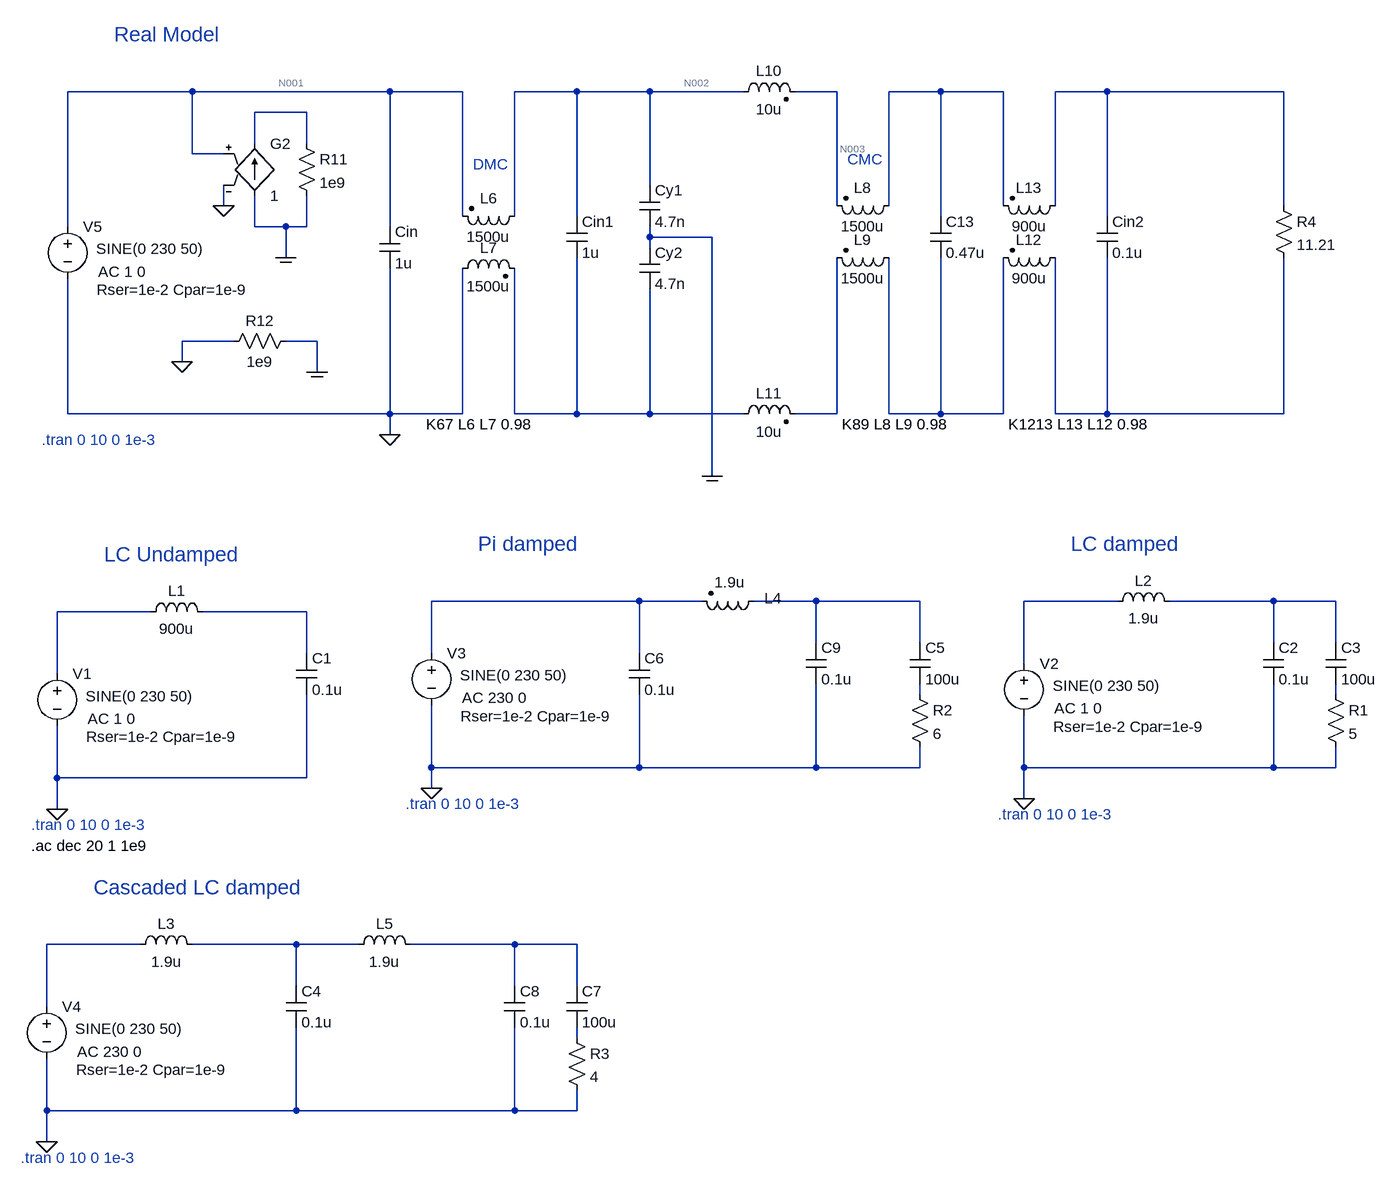
[diagram p0: schematic Input_Filter.asc]
Input_Filter.asc, the LTspice schematic file:
Version 4
SHEET 1 2692 3464
WIRE -2384 1808 -2576 1808
WIRE -2080 1808 -2384 1808
WIRE -1968 1808 -2080 1808
WIRE -1792 1808 -1888 1808
WIRE -1680 1808 -1792 1808
WIRE -1536 1808 -1680 1808
WIRE -1392 1808 -1456 1808
WIRE -1232 1808 -1312 1808
WIRE -1136 1808 -1232 1808
WIRE -976 1808 -1056 1808
WIRE -704 1808 -976 1808
WIRE -2208 1840 -2288 1840
WIRE -2288 1888 -2288 1840
WIRE -2208 1888 -2208 1840
WIRE -2384 1904 -2384 1808
WIRE -2336 1904 -2384 1904
WIRE -1680 1952 -1680 1808
WIRE -2336 1984 -2336 1952
WIRE -1392 1984 -1392 1808
WIRE -1312 1984 -1312 1808
WIRE -1136 1984 -1136 1808
WIRE -1056 1984 -1056 1808
WIRE -704 1984 -704 1808
WIRE -1968 2000 -1968 1808
WIRE -1888 2000 -1888 1808
WIRE -1792 2000 -1792 1808
WIRE -1232 2000 -1232 1808
WIRE -976 2000 -976 1808
WIRE -2576 2016 -2576 1808
WIRE -2288 2016 -2288 1968
WIRE -2240 2016 -2288 2016
WIRE -2208 2016 -2208 1968
WIRE -2208 2016 -2240 2016
WIRE -2080 2016 -2080 1808
WIRE -1680 2032 -1680 2016
WIRE -1584 2032 -1680 2032
WIRE -1680 2048 -1680 2032
WIRE -2240 2064 -2240 2016
WIRE -2320 2192 -2400 2192
WIRE -2192 2192 -2240 2192
WIRE -2400 2224 -2400 2192
WIRE -2192 2240 -2192 2192
WIRE -2576 2304 -2576 2096
WIRE -2080 2304 -2080 2080
WIRE -2080 2304 -2576 2304
WIRE -1968 2304 -1968 2080
WIRE -1968 2304 -2080 2304
WIRE -1888 2304 -1888 2080
WIRE -1792 2304 -1792 2064
WIRE -1792 2304 -1888 2304
WIRE -1680 2304 -1680 2112
WIRE -1680 2304 -1792 2304
WIRE -1536 2304 -1680 2304
WIRE -1392 2304 -1392 2064
WIRE -1392 2304 -1456 2304
WIRE -1312 2304 -1312 2064
WIRE -1232 2304 -1232 2064
WIRE -1232 2304 -1312 2304
WIRE -1136 2304 -1136 2064
WIRE -1136 2304 -1232 2304
WIRE -1056 2304 -1056 2064
WIRE -976 2304 -976 2064
WIRE -976 2304 -1056 2304
WIRE -704 2304 -704 2064
WIRE -704 2304 -976 2304
WIRE -2080 2336 -2080 2304
WIRE -1584 2400 -1584 2032
WIRE -1696 2592 -2016 2592
WIRE -1600 2592 -1696 2592
WIRE -1424 2592 -1520 2592
WIRE -1264 2592 -1424 2592
WIRE -960 2592 -1104 2592
WIRE -720 2592 -880 2592
WIRE -624 2592 -720 2592
WIRE -2448 2608 -2592 2608
WIRE -2208 2608 -2368 2608
WIRE -1424 2656 -1424 2592
WIRE -1264 2656 -1264 2592
WIRE -720 2656 -720 2592
WIRE -624 2656 -624 2592
WIRE -2208 2672 -2208 2608
WIRE -2016 2672 -2016 2592
WIRE -1696 2672 -1696 2592
WIRE -1104 2688 -1104 2592
WIRE -2592 2704 -2592 2608
WIRE -1264 2736 -1264 2720
WIRE -624 2736 -624 2720
WIRE -2016 2848 -2016 2752
WIRE -1696 2848 -1696 2736
WIRE -1696 2848 -2016 2848
WIRE -1424 2848 -1424 2720
WIRE -1424 2848 -1696 2848
WIRE -1264 2848 -1264 2816
WIRE -1264 2848 -1424 2848
WIRE -1104 2848 -1104 2768
WIRE -720 2848 -720 2720
WIRE -720 2848 -1104 2848
WIRE -624 2848 -624 2816
WIRE -624 2848 -720 2848
WIRE -2592 2864 -2592 2784
WIRE -2208 2864 -2208 2736
WIRE -2208 2864 -2592 2864
WIRE -2016 2880 -2016 2848
WIRE -1104 2896 -1104 2848
WIRE -2592 2912 -2592 2864
WIRE -2464 3120 -2608 3120
WIRE -2224 3120 -2384 3120
WIRE -2128 3120 -2224 3120
WIRE -1888 3120 -2048 3120
WIRE -1792 3120 -1888 3120
WIRE -2224 3184 -2224 3120
WIRE -1888 3184 -1888 3120
WIRE -1792 3184 -1792 3120
WIRE -2608 3216 -2608 3120
WIRE -1792 3264 -1792 3248
WIRE -2608 3376 -2608 3296
WIRE -2224 3376 -2224 3248
WIRE -2224 3376 -2608 3376
WIRE -1888 3376 -1888 3248
WIRE -1888 3376 -2224 3376
WIRE -1792 3376 -1792 3344
WIRE -1792 3376 -1888 3376
WIRE -2608 3424 -2608 3376
FLAG -2592 2912 0
FLAG -1104 2896 0
FLAG -2016 2880 0
FLAG -2608 3424 0
FLAG -2080 2336 0
FLAG -1584 2400 COM
FLAG -2240 2064 COM
FLAG -2336 1984 0
FLAG -2400 2224 0
FLAG -2192 2240 COM
DATAFLAG -2592 2864 ""
DATAFLAG -2592 2864 ""
DATAFLAG -1104 2848 ""
DATAFLAG -1104 2848 ""
DATAFLAG -2016 2832 ""
DATAFLAG -2016 2832 ""
DATAFLAG -2608 3376 ""
DATAFLAG -2608 3376 ""
DATAFLAG -2256 2608 ""
SYMBOL voltage -2592 2688 R0
WINDOW 3 44 50 Left 2
WINDOW 123 47 85 Left 2
WINDOW 39 45 113 Left 2
SYMATTR Value SINE(0 230 50)
SYMATTR Value2 AC 1 0
SYMATTR SpiceLine Rser=1e-2 Cpar=1e-9
SYMATTR InstName V1
SYMBOL ind -2464 2624 R270
WINDOW 0 32 56 VTop 2
WINDOW 3 5 56 VBottom 2
SYMATTR InstName L1
SYMATTR Value 900u
SYMBOL cap -2224 2672 R0
SYMATTR InstName C1
SYMATTR Value 0.1u
SYMBOL voltage -1104 2672 R0
WINDOW 3 44 50 Left 2
WINDOW 123 47 85 Left 2
WINDOW 39 45 113 Left 2
SYMATTR Value SINE(0 230 50)
SYMATTR Value2 AC 1 0
SYMATTR SpiceLine Rser=1e-2 Cpar=1e-9
SYMATTR InstName V2
SYMBOL ind -976 2608 R270
WINDOW 0 32 56 VTop 2
WINDOW 3 5 56 VBottom 2
SYMATTR InstName L2
SYMATTR Value 1.9u
SYMATTR SpiceLine Ipk=30 Rser=1e-9
SYMBOL cap -736 2656 R0
SYMATTR InstName C2
SYMATTR Value 0.1u
SYMBOL res -640 2720 R0
SYMATTR InstName R1
SYMATTR Value 5
SYMBOL cap -640 2656 R0
SYMATTR InstName C3
SYMATTR Value 100u
SYMBOL voltage -2016 2656 R0
WINDOW 3 44 50 Left 2
WINDOW 123 47 85 Left 2
WINDOW 39 45 113 Left 2
SYMATTR Value SINE(0 230 50)
SYMATTR Value2 AC 230 0
SYMATTR SpiceLine Rser=1e-2 Cpar=1e-9
SYMATTR InstName V3
SYMBOL res -1280 2720 R0
SYMATTR InstName R2
SYMATTR Value 6
SYMBOL cap -1280 2656 R0
SYMATTR InstName C5
SYMATTR Value 100u
SYMBOL cap -1712 2672 R0
SYMATTR InstName C6
SYMATTR Value 0.1u
SYMBOL cap -1440 2656 R0
SYMATTR InstName C9
SYMATTR Value 0.1u
SYMBOL ind2 -1504 2576 R90
WINDOW 0 27 -14 VBottom 2
WINDOW 3 -29 53 VTop 2
SYMATTR InstName L4
SYMATTR Value 1.9u
SYMATTR Type ind
SYMBOL voltage -2608 3200 R0
WINDOW 3 44 50 Left 2
WINDOW 123 47 85 Left 2
WINDOW 39 45 113 Left 2
SYMATTR Value SINE(0 230 50)
SYMATTR Value2 AC 230 0
SYMATTR SpiceLine Rser=1e-2 Cpar=1e-9
SYMATTR InstName V4
SYMBOL ind -2480 3136 R270
WINDOW 0 32 56 VTop 2
WINDOW 3 5 56 VBottom 2
SYMATTR InstName L3
SYMATTR Value 1.9u
SYMATTR SpiceLine Ipk=30 Rser=1e-9
SYMBOL cap -2240 3184 R0
SYMATTR InstName C4
SYMATTR Value 0.1u
SYMBOL res -1808 3248 R0
SYMATTR InstName R3
SYMATTR Value 4
SYMBOL cap -1808 3184 R0
SYMATTR InstName C7
SYMATTR Value 100u
SYMBOL ind -2144 3136 R270
WINDOW 0 32 56 VTop 2
WINDOW 3 5 56 VBottom 2
SYMATTR InstName L5
SYMATTR Value 1.9u
SYMATTR SpiceLine Ipk=30 Rser=1e-9
SYMBOL cap -1904 3184 R0
SYMATTR InstName C8
SYMATTR Value 0.1u
SYMBOL voltage -2576 2000 R0
WINDOW 3 44 50 Left 2
WINDOW 123 47 85 Left 2
WINDOW 39 45 113 Left 2
SYMATTR Value SINE(0 230 50)
SYMATTR Value2 AC 1 0
SYMATTR SpiceLine Rser=1e-2 Cpar=1e-9
SYMATTR InstName V5
SYMBOL cap -1248 2000 R0
SYMATTR InstName C13
SYMATTR Value 0.47u
SYMBOL cap -2096 2016 R0
SYMATTR InstName Cin
SYMATTR Value 1u
SYMBOL cap -1696 1952 R0
SYMATTR InstName Cy1
SYMATTR Value 4.7n
SYMBOL cap -1696 2048 R0
SYMATTR InstName Cy2
SYMATTR Value 4.7n
SYMBOL ind2 -1872 1984 R90
WINDOW 0 4 56 VBottom 2
WINDOW 3 32 56 VTop 2
SYMATTR InstName L6
SYMATTR Value 1500u
SYMATTR Type ind
SYMBOL ind2 -1984 2096 R270
WINDOW 0 32 56 VTop 2
WINDOW 3 4 56 VBottom 2
SYMATTR InstName L7
SYMATTR Value 1500u
SYMATTR Type ind
SYMBOL ind2 -1296 1968 R90
WINDOW 0 4 56 VBottom 2
WINDOW 3 32 56 VTop 2
SYMATTR InstName L8
SYMATTR Value 1500u
SYMATTR Type ind
SYMBOL ind2 -1296 2048 R90
WINDOW 0 4 56 VBottom 2
WINDOW 3 32 56 VTop 2
SYMATTR InstName L9
SYMATTR Value 1500u
SYMATTR Type ind
SYMBOL cap -1808 2000 R0
SYMATTR InstName Cin1
SYMATTR Value 1u
SYMBOL cap -992 2000 R0
SYMATTR InstName Cin2
SYMATTR Value 0.1u
SYMBOL ind2 -1040 2048 R90
WINDOW 0 4 56 VBottom 2
WINDOW 3 32 56 VTop 2
SYMATTR InstName L12
SYMATTR Value 900u
SYMATTR Type ind
SYMATTR SpiceLine Rser=0.1
SYMBOL ind2 -1040 1968 R90
WINDOW 0 4 56 VBottom 2
WINDOW 3 32 56 VTop 2
SYMATTR InstName L13
SYMATTR Value 900u
SYMATTR Type ind
SYMATTR SpiceLine Rser=0.1
SYMBOL res -720 1968 R0
SYMATTR InstName R4
SYMATTR Value 11.21
SYMBOL ind2 -1552 1824 R270
WINDOW 0 32 56 VTop 2
WINDOW 3 4 56 VBottom 2
SYMATTR InstName L10
SYMATTR Value 10u
SYMATTR Type ind
SYMBOL ind2 -1552 2320 R270
WINDOW 0 32 56 VTop 2
WINDOW 3 4 56 VBottom 2
SYMATTR InstName L11
SYMATTR Value 10u
SYMATTR Type ind
SYMBOL res -2224 1872 R0
SYMATTR InstName R11
SYMATTR Value 1e9
SYMBOL res -2224 2176 R90
WINDOW 0 0 56 VBottom 2
WINDOW 3 32 56 VTop 2
SYMATTR InstName R12
SYMATTR Value 1e9
SYMBOL g -2288 1872 R0
SYMATTR InstName G2
SYMATTR Value 1
TEXT -2520 2520 Left 3 ;LC Undamped
TEXT -2632 2936 Left 2 ;.tran 0 10 0 1e-3
TEXT -1032 2504 Left 3 ;LC damped
TEXT -1144 2920 Left 2 ;.tran 0 10 0 1e-3
TEXT -2632 2968 Left 2 !.ac dec 20 1 1e9
TEXT -1944 2504 Left 3 ;Pi damped
TEXT -2056 2904 Left 2 ;.tran 0 10 0 1e-3
TEXT -2536 3032 Left 3 ;Cascaded LC damped
TEXT -2648 3448 Left 2 ;.tran 0 10 0 1e-3
TEXT -2504 1720 Left 3 ;Real Model
TEXT -2616 2344 Left 2 ;.tran 0 10 0 1e-3
TEXT -2024 2320 Left 2 !K67 L6 L7 0.98
TEXT -1384 2320 Left 2 !K89 L8 L9 0.98
TEXT -1952 1920 Left 2 ;DMC
TEXT -1376 1912 Left 2 ;CMC
TEXT -1128 2320 Left 2 !K1213 L13 L12 0.98

The netlist it stands for:
* Input_Filter.asc
V1 N015 0 SINE(0 230 50) AC 1 0 Rser=1e-2 Cpar=1e-9
L1 N015 N016 900u
C1 N016 0 0.1u
V2 N013 0 SINE(0 230 50) AC 1 0 Rser=1e-2 Cpar=1e-9
L2 N013 N014 1.9u Ipk=30 Rser=1e-9
C2 N014 0 0.1u
R1 N018 0 5
C3 N014 N018 100u
V3 N011 0 SINE(0 230 50) AC 230 0 Rser=1e-2 Cpar=1e-9
R2 N017 0 6
C5 N012 N017 100u
C6 N011 0 0.1u
C9 N012 0 0.1u
L4 N012 N011 1.9u
V4 N019 0 SINE(0 230 50) AC 230 0 Rser=1e-2 Cpar=1e-9
L3 N019 N020 1.9u Ipk=30 Rser=1e-9
C4 N020 0 0.1u
R3 N022 0 4
C7 N021 N022 100u
L5 N020 N021 1.9u Ipk=30 Rser=1e-9
C8 N021 0 0.1u
V5 N001 0 SINE(0 230 50) AC 1 0 Rser=1e-2 Cpar=1e-9
C13 N004 N009 0.47u
Cin N001 0 1u
Cy1 N002 COM 4.7n
Cy2 COM N007 4.7n
L6 N002 N001 1500u
L7 0 N007 1500u
L8 N004 N003 1500u
L9 N009 N008 1500u
Cin1 N002 N007 1u
Cin2 N005 N010 0.1u
L12 N010 N009 900u Rser=0.1
L13 N005 N004 900u Rser=0.1
R4 N005 N010 11.21
L10 N002 N003 10u
L11 N007 N008 10u
R11 N006 COM 1e9
R12 COM 0 1e9
G2 COM N006 N001 0 1
* LC Undamped
* .tran 0 10 0 1e-3
* LC damped
* .tran 0 10 0 1e-3
.ac dec 20 1 1e9
* Pi damped
* .tran 0 10 0 1e-3
* Cascaded LC damped
* .tran 0 10 0 1e-3
* Real Model
* .tran 0 10 0 1e-3
K67 L6 L7 0.98
K89 L8 L9 0.98
* DMC
* CMC
K1213 L13 L12 0.98
.backanno
.end

* Results of the author's LTspice run, read from the files saved beside the schematic
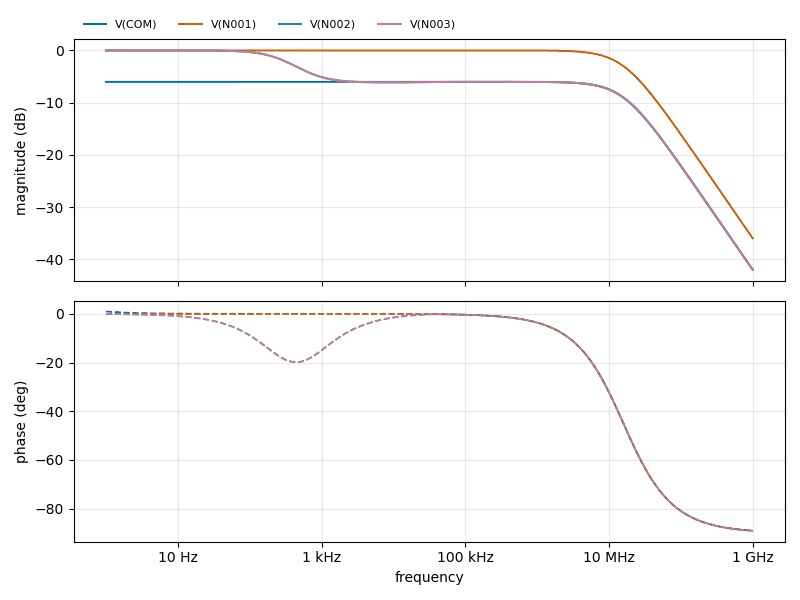
[diagram p1: AC Analysis of Input_Filter.asc, plotted from the saved traces]
* AC Analysis, 1 run:
*   V(COM): -6.03 dB at 1 Hz, -41.99 dB at 1 GHz, peak -6.02 dB at 14.13 kHz, 3 dB below the peak at 15.9 MHz
*   V(N001): -0.01 dB at 1 Hz, -35.97 dB at 1 GHz, peak -0.00 dB at 14.13 kHz, 3 dB below the peak at 15.9 MHz
*   V(N002): -0.01 dB at 1 Hz, -41.99 dB at 1 GHz, peak -0.01 dB at 1 Hz, 3 dB below the peak at 433 Hz
*   V(N003): -0.01 dB at 1 Hz, -41.99 dB at 1 GHz, peak -0.01 dB at 1 Hz, 3 dB below the peak at 431.6 Hz